# Altium schematic sheet AY Amp.SchDoc
size A3
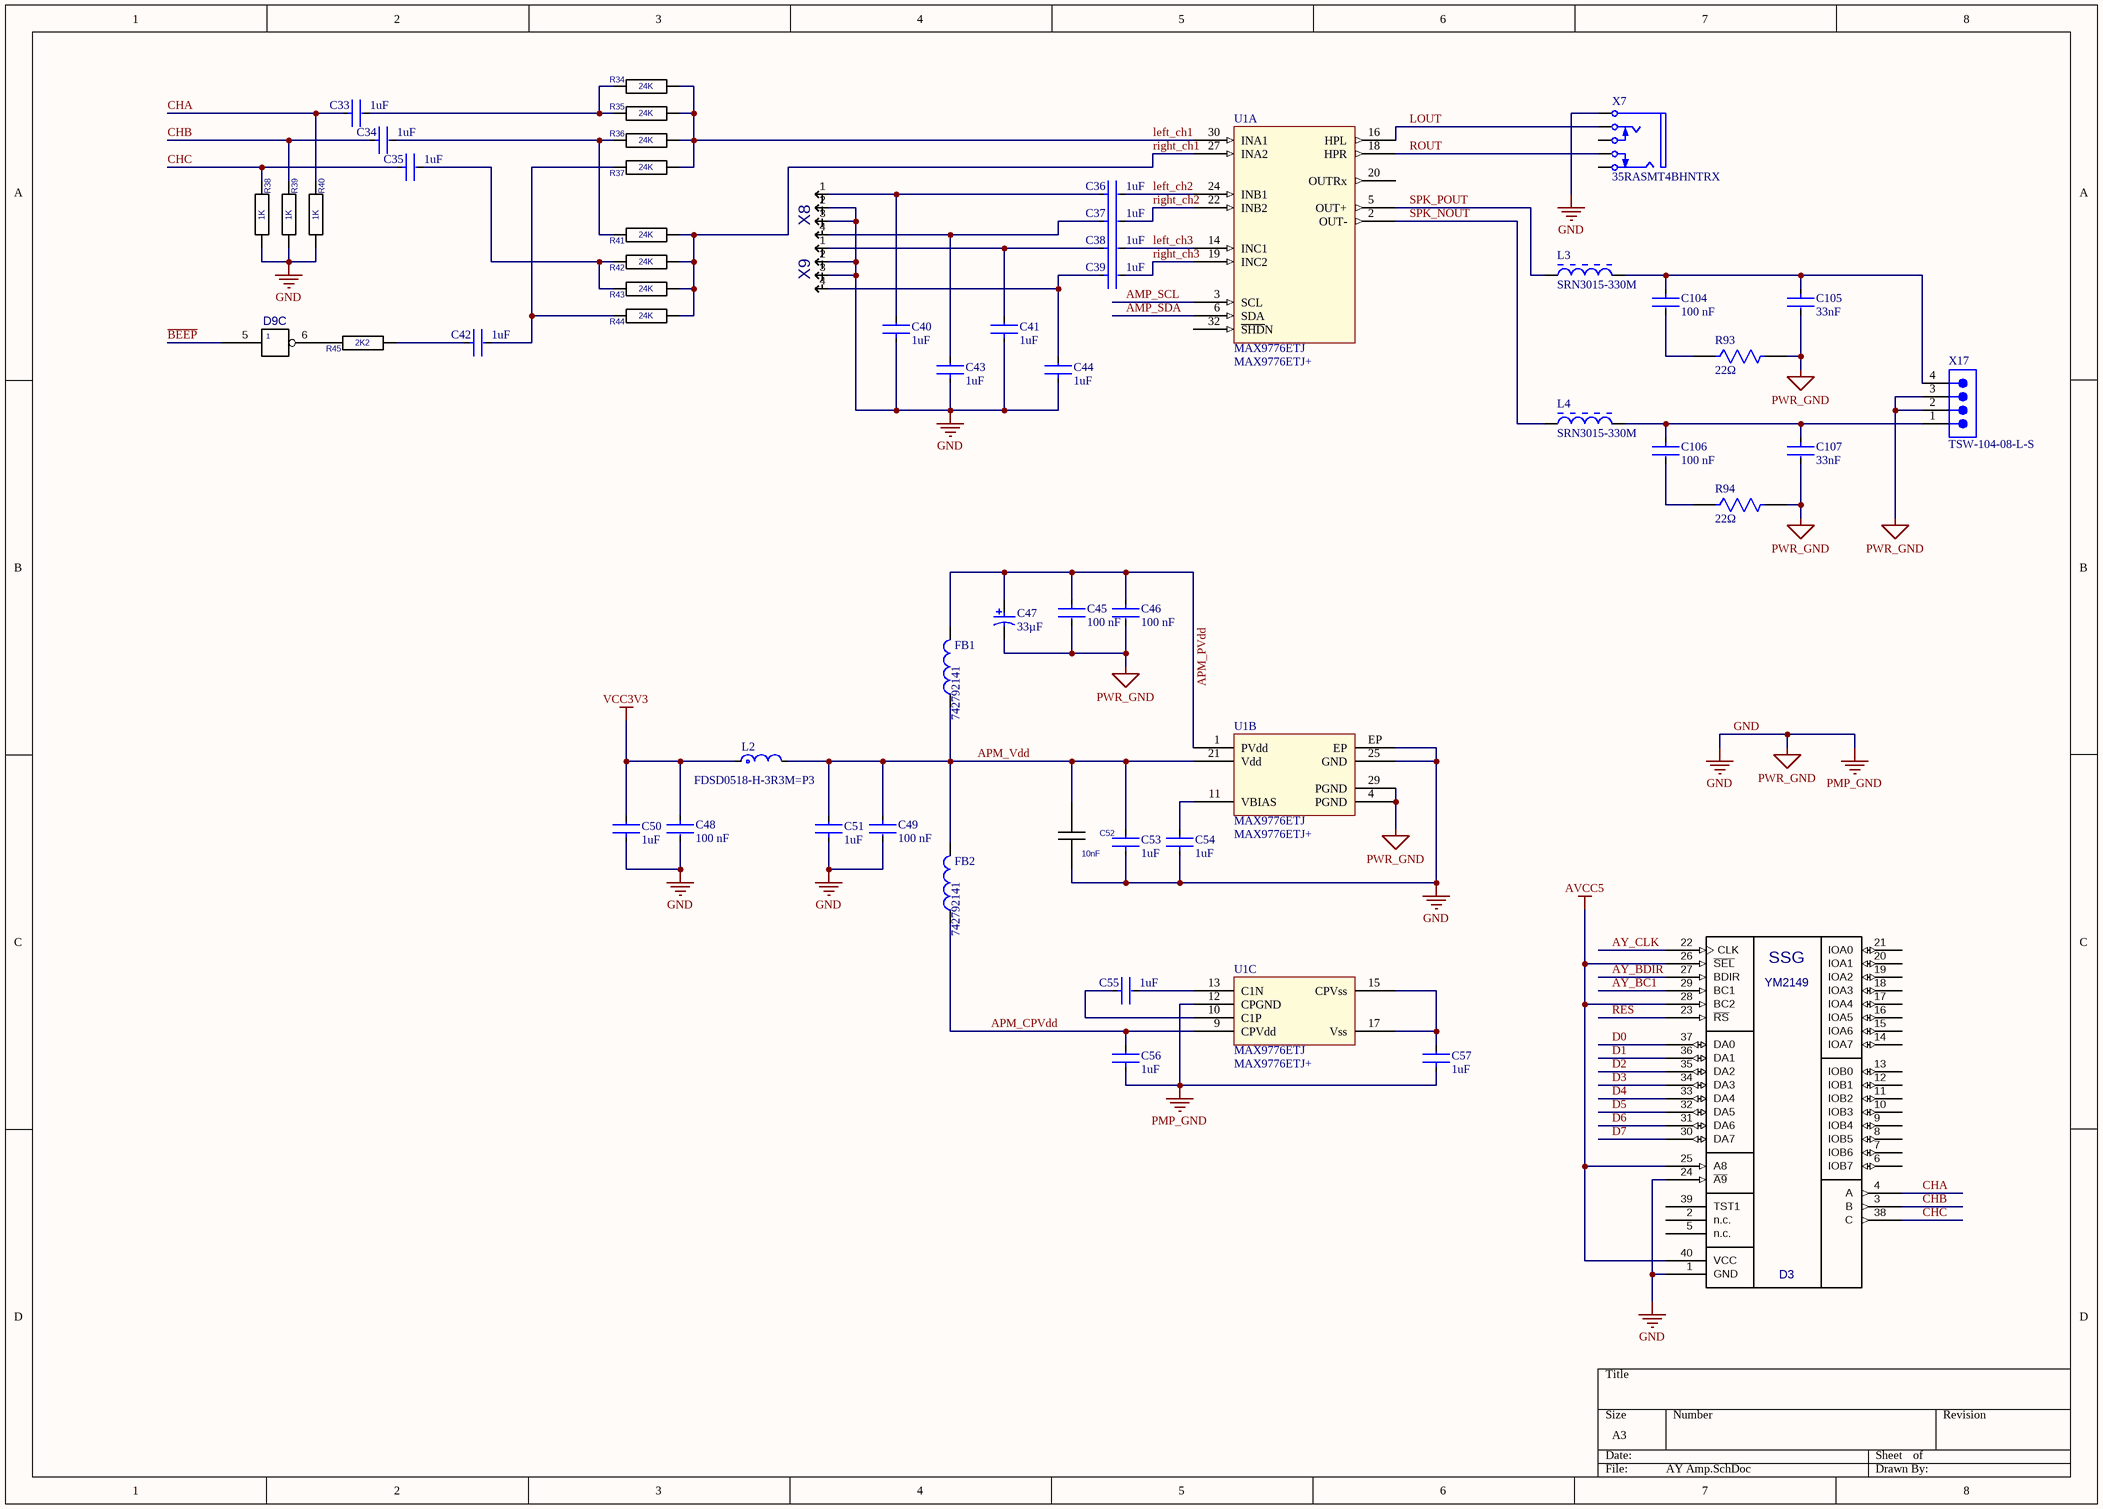
[diagram p0: AY Amp.SchDoc]

## Parts
C33  Capacitance: 1uF  [FP-GCM21B-0_15-IPC_A]  (hidden comment: GCM21BR71E105KA56L)
C34  Capacitance: 1uF  [FP-GCM21B-0_15-IPC_A]  (hidden comment: GCM21BR71E105KA56L)
C35  Capacitance: 1uF  [FP-GCM21B-0_15-IPC_A]  (hidden comment: GCM21BR71E105KA56L)
C36  Capacitance: 1uF  [FP-GCM21B-0_15-IPC_A]  (hidden comment: GCM21BR71E105KA56L)
C37  Capacitance: 1uF  [FP-GCM21B-0_15-IPC_A]  (hidden comment: GCM21BR71E105KA56L)
C38  Capacitance: 1uF  [FP-GCM21B-0_15-IPC_A]  (hidden comment: GCM21BR71E105KA56L)
C39  Capacitance: 1uF  [FP-GCM21B-0_15-IPC_A]  (hidden comment: GCM21BR71E105KA56L)
C40  Capacitance: 1uF  [FP-GCM21B-0_15-IPC_A]  (hidden comment: GCM21BR71E105KA56L)
C41  Capacitance: 1uF  [FP-GCM21B-0_15-IPC_A]  (hidden comment: GCM21BR71E105KA56L)
C42  Capacitance: 1uF  [FP-GCM21B-0_15-IPC_A]  (hidden comment: GCM21BR71E105KA56L)
C43  Capacitance: 1uF  [FP-GCM21B-0_15-IPC_A]  (hidden comment: GCM21BR71E105KA56L)
C44  Capacitance: 1uF  [FP-GCM21B-0_15-IPC_A]  (hidden comment: GCM21BR71E105KA56L)
C45  Capacitance: 100 nF  [FP-CC0805-0_85-IPC_A]  (hidden comment: CC0805KRX7R8BB104)
C46  Capacitance: 100 nF  [FP-CC0805-0_85-IPC_A]  (hidden comment: CC0805KRX7R8BB104)
C47  Capacitance: 33µF  [CAPMP3529X21-T_V]  (hidden comment: TAJB336K016RNJ)
C48  Capacitance: 100 nF  [FP-CC0805-0_85-IPC_A]  (hidden comment: CC0805KRX7R8BB104)
C49  Capacitance: 100 nF  [FP-CC0805-0_85-IPC_A]  (hidden comment: CC0805KRX7R8BB104)
C50  Capacitance: 1uF  [FP-GCM21B-0_15-IPC_A]  (hidden comment: GCM21BR71E105KA56L)
C51  Capacitance: 1uF  [FP-GCM21B-0_15-IPC_A]  (hidden comment: GCM21BR71E105KA56L)
C52  value 10nF  [C-CHIP]  (hidden comment: CAPCHIP)
C53  Capacitance: 1uF  [FP-GCM21B-0_15-IPC_A]  (hidden comment: GCM21BR71E105KA56L)
C54  Capacitance: 1uF  [FP-GCM21B-0_15-IPC_A]  (hidden comment: GCM21BR71E105KA56L)
C55  Capacitance: 1uF  [FP-GCM21B-0_15-IPC_A]  (hidden comment: GCM21BR71E105KA56L)
C56  Capacitance: 1uF  [FP-GCM21B-0_15-IPC_A]  (hidden comment: GCM21BR71E105KA56L)
C57  Capacitance: 1uF  [FP-GCM21B-0_15-IPC_A]  (hidden comment: GCM21BR71E105KA56L)
C104  Capacitance: 100 nF  [FP-CC0805-0_85-IPC_A]  (hidden comment: CC0805KRX7R8BB104)
C105  Capacitance: 33nF  [FP-CL21-IPC_A]  (hidden comment: CL21B333KBANNNC)
C106  Capacitance: 100 nF  [FP-CC0805-0_85-IPC_A]  (hidden comment: CC0805KRX7R8BB104)
C107  Capacitance: 33nF  [FP-CL21-IPC_A]  (hidden comment: CL21B333KBANNNC)
D3  YM2149  [DIP40]
D9  CD4069M  [SO14]  (value not drawn)  (part C of 6)
FB1  742792141  [SMD-1206]
FB2  742792141  [SMD-1206]
L2  FDSD0518-H-3R3M=P3  [FP-FDSD0518-MFG]
L3  SRN3015-330M  [BOUR-SRN3015-2_V]
L4  SRN3015-330M  [BOUR-SRN3015-2_V]
R34  value 24K  [R-CHIP]  (hidden comment: RESCHIP)
R35  value 24K  [R-CHIP]  (hidden comment: RESCHIP)
R36  value 24K  [R-CHIP]  (hidden comment: RESCHIP)
R37  value 24K  [R-CHIP]  (hidden comment: RESCHIP)
R38  value 1K  [R-CHIP]  (hidden comment: RESCHIP)
R39  value 1K  [R-CHIP]  (hidden comment: RESCHIP)
R40  value 1K  [R-CHIP]  (hidden comment: RESCHIP)
R41  value 24K  [R-CHIP]  (hidden comment: RESCHIP)
R42  value 24K  [R-CHIP]  (hidden comment: RESCHIP)
R43  value 24K  [R-CHIP]  (hidden comment: RESCHIP)
R44  value 24K  [R-CHIP]  (hidden comment: RESCHIP)
R45  value 2K2  [R-CHIP]  (hidden comment: RESCHIP)
R93  Resistance: 22Ω  [FP-AC0805-IPC_A]  (hidden comment: AC0805JR-0722RL)
R94  Resistance: 22Ω  [FP-AC0805-IPC_A]  (hidden comment: AC0805JR-0722RL)
U1  MAX9776ETJ  Supplier Part Number 1: MAX9776ETJ+  [QFN50P500X500X75_HS-33M]  (parts A,B,C of 3)
X7  35RASMT4BHNTRX  [SWIT-35RASMT4BHNTRX_V]
X8  PLB1-4I  [PLB1-4I]  (value not drawn)
X9  PLB1-4I  [PLB1-4I]  (value not drawn)
X17  TSW-104-08-L-S  [SMTC-TSW-104-08-X-S]

## Nets
AGND: D9.7(GND)
AVCC5: D3.25(A8) D3.26(~{SEL}) D3.28(BC2) D3.40(VCC) D9.14(+5v)
GND: C40.1 C41.1 C43.1 C44.1 C45.2 C46.2 C47.2 C48.2 C49.2 C50.1 C51.1 C52.2 C53.1 C54.1 C56.1 C57.1 C105.2 C107.2 D3.1(GND) D3.24(~{A9}) R38.1(i/o) R39.1(i/o) R40.1(i/o) R93.2 R94.2 U1.4(PGND) U1.12(CPGND) U1.25(GND) U1.29(PGND) U1.EP X7.1 X8.2(I/O2) X8.3(I/O3) X9.2(I/O2) X9.3(I/O3) X17.2 X17.3  [also labelled PMP_GND, PWR_GND]
VCC3V3: C48.1 C50.2 L2.1
AMP_SCL: U1.3(SCL)
AMP_SDA: U1.6(SDA)
APM_CPVdd: C56.2 FB2.1 U1.9(CPVdd)
APM_PVdd: C45.1 C46.1 C47.1 FB1.2 U1.1(PVdd)
APM_Vdd: C49.1 C51.2 C52.1 C53.2 FB1.1 FB2.2 L2.2 U1.21(Vdd)
AY_BC1: D3.29(BC1)
AY_BDIR: D3.27(BDIR)
AY_CLK: D3.22(CLK)
~{BEEP}: D9.5
CHA: C33.1 D3.4(A) R40.2(i/o1)
CHB: C34.1 D3.3(B) R39.2(i/o1)
CHC: C35.1 D3.38(C) R38.2(i/o1)
D0: D3.37(DA0)
D1: D3.36(DA1)
D2: D3.35(DA2)
D3: D3.34(DA3)
D4: D3.33(DA4)
D5: D3.32(DA5)
D6: D3.31(DA6)
D7: D3.30(DA7)
left_ch1: R34.1(i/o) R35.1(i/o) R36.1(i/o) R37.1(i/o) U1.30(INA1)
left_ch2: C36.2 U1.24(INB1)
left_ch3: C38.2 U1.14(INC1)
LOUT: U1.16(HPL) X7.3
~{RES}: D3.23(~{RS})
right_ch1: R41.1(i/o) R42.1(i/o) R43.1(i/o) R44.1(i/o) U1.27(INA2)
right_ch2: C37.2 U1.22(INB2)
right_ch3: C39.2 U1.19(INC2)
ROUT: U1.18(HPR) X7.4
SPK_NOUT: L4.1 U1.2(OUT-)
SPK_POUT: L3.1 U1.5(OUT+)
NetC33_2: C33.2 R34.2(i/o1) R35.2(i/o1)
NetC34_2: C34.2 R36.2(i/o1) R41.2(i/o1)
NetC35_2: C35.2 R42.2(i/o1) R43.2(i/o1)
NetC36_1: C36.1 C40.2 X8.1(I/O1)
NetC37_1: C37.1 C43.2 X8.4(I/O4)
NetC38_1: C38.1 C41.2 X9.1(I/O1)
NetC39_1: C39.1 C44.2 X9.4(I/O4)
NetC42_1: C42.1 R45.1(i/o)
NetC42_2: C42.2 R37.2(i/o1) R44.2(i/o1)
NetC54_2: C54.2 U1.11(VBIAS)
NetC55_1: C55.1 U1.10(C1P)
NetC55_2: C55.2 U1.13(C1N)
NetC57_2: C57.2 U1.15(CPVss) U1.17(Vss)
NetC104_1: C104.1 C105.1 L3.2 X17.4
NetC104_2: C104.2 R93.1
NetC106_1: C106.1 C107.1 L4.2 X17.1
NetC106_2: C106.2 R94.1
NetD9_6: D9.6 R45.2(i/o1)

Not connected (* = marked no-connect by the designer): D3 2(n.c.) 5(n.c.) 6(IOB7) 7(IOB6) 8(IOB5) 9(IOB4) 10(IOB3) 11(IOB2) 12(IOB1) 13(IOB0) 14(IOA7) 15(IOA6) 16(IOA5) 17(IOA4) 18(IOA3) 19(IOA2) 20(IOA1) 21(IOA0) 39(TST1); U1 7(I.C.) 8(I.C.) 20(OUTRx) 23(I.C.) 26(I.C.) 28(I.C.) 31(I.C.) 32(~{SHD}N); X7 2 5

## Notes on the sheet
- (in symbol YM2149) SSG

## Library data of the parts
C33-C44 C50 C51 C53-C57 = CMP-2007-03346-2: Ceramic Capacitor for Automotive 1uF ±10% 25VDC X7R 0805 Embossed T/R; Voltage Rating (DC): 25V; Dielectric: X7R; Max Operating Temperature: 125°C; Lead Free: Lead Free; Ratings: AEC-Q200; Voltage Rating: 25V; Case Code (Imperial): 0805; Package Quantity: 3000; Termination: SMD/SMT; Packaging: Tape and Reel; Tolerance: 10%; Length: 2mm; Voltage: 25V; Radiation Hardening: No; Depth: 1.25mm; Case/Package: 0805; Thickness: 0.055inch; Width: 0.049inch; Min Operating Temperature: -55°C; Mount: Surface Mount; REACH SVHC: No SVHC; Case Code (Metric): 2012; Height: 1.25mm
C45 C46 C48 C49 C104 C106 = CMP-1036-04410-2: CAP CER 0.1UF 25V X7R 0805; Manufacturer: Yageo; Tolerance: 0.1; Material: Ceramic; Value: 100 nF; ComponentLink2URL: http://www.yageo.com/documents/recent/UPY-GPHC_Y5V_6.3V-to-50V_8.pdf; Category: Cap; Mouser Description: Multilayer Ceramic Capacitors MLCC - SMD/SMT 100nF 25V X7R 10%; Manufacturer Part Number: CC0805KRX7R8BB104; Device Class L1: Passive Components; Footprint Url: http://www.yageo.com/exep/pages/download/literatures/UPY-C_GEN_24.pdf; Height: 0.95mm; Digikey Description: CAP CER 0.1UF 25V X7R 0805; Lead Free: Yes; Temperature Range High: +85°C; Temperature: -30°C to +85°C; Ipc Land Pattern Name: CAPC200125X85; Automotive: No; Octopart: https://octopart.com/cc0805krx7r8bb104-yageo-39467766; Device Class L2: Capacitors; Temperature Characteristic: X7R; Voltage Rating: 25 V; ComponentLink2Description: Datasheet; Temperature Range Low: -30°C; Device Class L3: Ceramic Capacitors; RoHS: TRUE; Package: CC0805-0.85
C47 = CMP-2000-07224-1: Standard Tantalum, 33 uF, +/- 10%, 16 V, -55 to 125 degC, 2-Pin SMD, RoHS, Tape and Reel; Manufacturer: AVX; Manufacturer Size Code: B; PCN Part Number: TAJSeriesSuffix08/Dec/2008; Other Names: 478-1688-1; Kits: 478-3443-ND-KITTANTCAPTAJSERIES; Product Training Modules: ComponentSolutionsforSmartMeterApplications; Catalog Drawings: TAJSeriesSideTAJSeries; ESR (Equivalent Series Resistance): 2.1Ohm; EDA / CAD Models: DownloadfromAcceleratedDesigns; Voltage - Rated: 16V; Type: Molded; Online Catalog: TAJSeries; Lead Spacing: -; Family: TantalumCapacitors; Series: TAJ; Package Reference: CAPMP3529X21-T; Package / Case: 1210(3528Metric); Category: Capacitors; Packaging: CutTape(CT); Lifetime @ Temp.: -; Package URL: http://www.avx.com/download/software/literature/AVX-Footprint-Library.pdf; Tolerance: ±10%; Manufacturer URL: http://www.avx.com/; Package Description: 2-Pin Surface Mount Device, Body 3.5 x 2.85 mm; Features: GeneralPurpose; Height - Seated (Max): 0.083"(2.10mm); Mounting Technology: SurfaceMount; Datasheet Version: 02/2016; Datasheet URL: http://datasheets.avx.com/TAJ.pdf; Operating Temperature: -55°C~125°C; Standard Package: 1; Size / Dimension: 0.138"Lx0.110"W(3.50mmx2.80mm); Mounting Type: SurfaceMount
C105 C107 = CMP-13271-001257-1: CL21 Series 0805 33nF 50V ±10% Tolerance X7R Multilayer Ceramic Chip Capacitor; Lead Free: Lead Free; Case Code (Imperial): 0805; Case/Package: 0805; Depth: 1.25mm; Package Quantity: 1; Radiation Hardening: No; Max Operating Temperature: 125°C; Min Operating Temperature: -55°C; Length: 2mm; Voltage Rating (DC): 50V; Material: Ceramic; Thickness: 0.03inch; Height: 0.65mm; Voltage Rating: 50V; Dielectric: X7R; Mount: Surface Mount; Voltage: 50V; Tolerance: 10%; Width: 0.049inch; Case Code (Metric): 2012; Packaging: Tape and Reel
FB1 FB2 = CMP-0220-00011-1: SMD EMI Suppression Ferrite Bead WE-CBF, Z = 1000 Ohm; Impedance: 1000 Ohm; PackageReference: SMD-1206; ComponentLink1URL: http://www.we-online.com; PackageVersion: 2007; DatasheetVersion: Dec-2005; ComponentLink1Description: Manufacturer Link; PackageDescription: Chip Inductor, 2-Leads, Body 3.2 x 1.6 mm; ComponentLink2Description: Datasheet; ComponentLink2URL: http://www.we-online.de/katalog/media/pdf/742792141.pdf
L2 = CMP-06042-016056-1: FIXED IND 3.3UH 3.4A 58 MOHM SMD; Tolerance: 20%; Saturation Current: 4.6A; DC Resistance (DCR): 58mR; Test Frequency: 100kHz; Shielding: Shielded; Core Material: Ferrite; Packaging: Tape and Reel; Current Rating: 3.4A; Resistor Type: Wirewound; Depth: 4.9mm; Inductance: 3.3uH; Width: 0.193inch; RoHS Compliant: Yes; Height - Seated (Max): 0.071inch; Mount: Surface Mount; Length: 0.205inch; Case/Package: Nonstandard; Max DC Current: 3.4A
L3 L4 = CMP-0007-00002-1: Semi-shielded Power Inductor, 33 uH, +/- 20%, 0.5 A, -40 to 125 degC, 3 x 3 x 1.5 mm SMD, RoHS and Halogen Free, Tape and Reel; Manufacturer: Bourns; DCR Max: 0.959 Ohm; Resistance to Solder Heat: +260 degC for 10 sec.; Inductance: 33 uH; Isat: 0.46 A; Rated current: 0.5 A; SRF Min: 22 MHz; Inductance tolerance: +/- 20%; Packing: Tape and Reel; PackageDescription: 2-Pin SMD, Body 3 x 3 mm, Height 1.5 mm; Operating Temperature: -40 to 125 degC; Mounting Technology: Surface Mount; ComponentLink3Description: Package Specification; DatasheetVersion: Aug-11; ComponentLink3URL: http://www.bourns.com/data/global/pdfs/SRN3015.pdf; RoHS: TRUE; PartNumber: SRN3015-330M; ComponentLink2Description: Datasheet; ComponentLink2URL: http://www.bourns.com/data/global/pdfs/SRN3015.pdf; ComponentLink1Description: Manufacturer URL; PackageReference: SRN3015; ComponentLink1URL: http://www.bourns.com/
R93 R94 = CMP-03412-037428-1: RES SMD 22 OHM 5% 1/8W 0805; Manufacturer: Yageo; Value: 22Ω; Automotive Grade: Grade 0; Voltage Rating: 150V; Tolerance: 0.05; Temperature Range High: +155°C; Ipc Land Pattern Name: RESC200125X50; Series: AC; Temperature: -55°C to +155°C; Octopart: https://octopart.com/ac0805jr-0722rl-yageo-25972001; Digikey Description: RES SMD 22 OHM 5% 1/8W 0805; Height: 0.6mm; ComponentLink2URL: http://www.yageo.com/documents/recent/PYu-AC_51_RoHS_L_6.pdf; Composition: Thick Film; Automotive: Yes; Mouser Description: Thick Film Resistors 1/8W 22ohm 5% AEC-Q200; Device Class L3: Chip SMD Resistors; Device Class L2: Resistors; Power Rating: 1/8W; Device Class L1: Passive Components; Category: Res; RoHS: TRUE; ComponentLink2Description: Datasheet; Temperature Range Low: -55°C; Package: AC0805; Footprint Url: http://www.yageo.com/exep/pages/download/literatures/PYu-R_Mount_10.pdf; Lead Free: Yes; Manufacturer Part Number: AC0805JR-0722RL
U1 = MAX9776ETJ: Audio Amp Headphone/Receiver/Speaker 1-CH Mono/2-CH Stereo 1.5W Class-D 32-Pin TQFN EP; Manufacturer: Maxim; Voltage Gain: 12dB; Min Dual Supply Voltage: 2.7V; Max Dual Supply Voltage: 5.5V; Power Supply Rejection Ratio (PSRR): 80dB; Common Mode Rejection Ratio: 45dB; Max Power Dissipation: 1.36W; Nominal Supply Current: 9.5mA; Dual Supply Voltage: 5V; Supply Type: Triple; Gain Bandwidth Product: 20kHz; Manufacturer Part Number: MAX9776ETJ+; RoHS: Yes; Category: Amplifiers - Audio; Stock 1: 240; Mount: Surface Mount; Number of Pins: 32; Min Operating Temperature: -40°C; Max Operating Temperature: 85°C; Packaging: Rail/Tube; Max Output Power: 1.5W; Package Quantity: 1; Logic Function: Receiver; Features: I²C; Output Power: 1.5W; Max Supply Voltage: 5.5V; Min Supply Voltage: 2.7V; Series: DirectDrive®; Supply Current: 9.5mA; Length: 5.1mm; Width: 5.1mm; Height: 0.75mm; Radiation Hardening: No; RoHS Compliant: Yes; ComponentLink1URL: https://datasheet.ciiva.com/1790/max9775-max9776-1790309.pdf?src-supplier=Digi-Key; ComponentLink1Description: https://datasheet.ciiva.com/1790/max9775-max9776-1790309.pdf?src-supplier=Digi-Key; ComponentLink2URL: https://datasheet.ciiva.com/17309/max9775-max9776-17309659.pdf?src-supplier=Avnet+Europe; ComponentLink2Description: https://datasheet.ciiva.com/17309/max9775-max9776-17309659.pdf?src-supplier=Avnet+Europe; ComponentLink3URL: https://datasheet.ciiva.com/2967/max9775-max9776-2967997.pdf?src-supplier=Avnet; ComponentLink3Description: https://datasheet.ciiva.com/2967/max9775-max9776-2967997.pdf?src-supplier=Avnet
X7 = CMP-1772-00001-1: Female 3.5 mm Phone Jack, 5 Position, Height 5 mm, RoHS, Tape and Reel; Current Rating: 50 mA; Voltage Rating (DC): 12 V; ComponentLink1URL: http://www.switchcraft.com/; ComponentLink2Description: Datasheet; ComponentLink2URL: http://www.switchcraft.com/Drawings/35rasmt4bhntrx_cd.pdf; PackageDescription: Female 3.5 mm Phone Jack, 5 Position, Height 5 mm; PackageReference: 35RASMT4BHNTRX; Mount: Through Hole; DatasheetVersion: Rev. C, 07/2014; Contact Material: Silver; ComponentLink1Description: Manufacturer URL; Packaging: Tape and Reel; RoHSCompliant: true; Contact Plating: Silver; Package Quantity: 3000
X17 = CMP-1024-00358-1: 0.025" SQ Post Header, Through-hole, Vertical, -55 to 125 degC, 2.54 mm Pitch, 4-Pin, Male, RoHS; Manufacturer: Samtec; Pitch: 2.54 mm; PartNumber: TSW-104-08-L-S; RoHS: True; Temperature Range: -55 to 125 degC; PackageDescription: .025[0.64] SQ. Post Terminal Strip Assembly; Orientation: Vertical; ComponentLink2URL: http://www.samtec.com/documents/webfiles/pdf/TSW_TH.PDF; ComponentLink1Description: Manufacturer URL; ComponentLink2Description: Datasheet; PackageVersion: DM, 8/1988; ComponentLink3URL: http://www.samtec.com/documents/webfiles/cpdf/TSW-XXX-XX-XXX-X-XX-XXX-MKT.pdf; Mounting Technology: Through-hole; PackageReference: TSW-104-08-X-S; ComponentLink3Description: Package Specification; ComponentLink1URL: http://www.samtec.com; DatasheetVersion: F-214
D3 = YM2149: Value: *
X8 X9 = PLB1-4I: Value: *